# Altium schematic sheet 5V Supply and Protection.SchDoc
size A
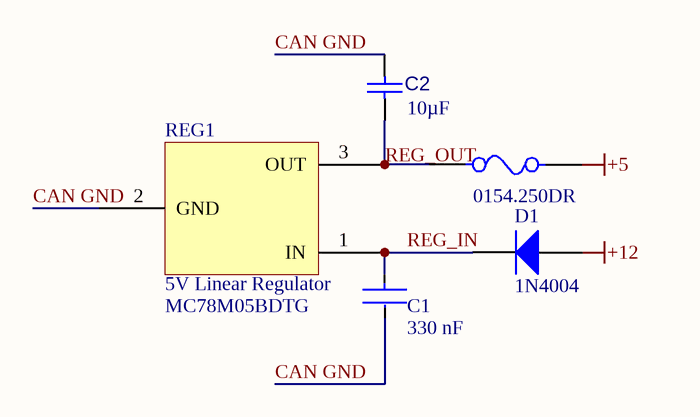
[diagram p0: 5V Supply and Protection.SchDoc]

## Parts
C1  value 330 nF  [FP-CC0603-DA-MFG]  (hidden comment: CC0603KRX7R7BB334)
C2  value 10µF  [CAPC0603(1608)100_L]  (hidden comment: Capacitor 10µF +/-20% 10V 0603)
D1  1N4004  [FAIR-DO-41-2]
FUSE  0154.250DR  [FP-0154-MFG]
REG1  MC78M05BDTG  [DPAK3]

## Nets
+5: FUSE.2
+12: D1.1(A)
CAN GND: C1.2 C2.2 REG1.2(GND)
REG_IN: C1.1 D1.2(K) REG1.1(IN)
REG_OUT: C2.1 FUSE.1 REG1.3(OUT)

## Notes on the sheet
- (in symbol MC78M05BDTG) 5V Linear Regulator

## Library data of the parts
C1 = CMP-03422-000838-1: CAP CER 0.33UF 16V X7R 0603; Manufacturer: YAGEO; Material: Ceramic; Tolerance: 0.1; Temperature Coefficient: 15%; Package: CC0603-DA; Footprint Url: http://www.yageo.com/exep/pages/download/literatures/UPY-C_GEN_24.pdf; Lead Free: Yes; Temperature: -55°C to +125°C; RoHS: TRUE; Temperature Range High: +125°C; Mouser Description: Multilayer Ceramic Capacitors MLCC - SMD/SMT 330nF 16V X7R 10%; Category: Cap; Temperature Characteristic: X7R; Octopart: https://octopart.com/cc0603krx7r7bb334-yageo-9291796; Voltage: 16 V; Device Class L1: Passive Components; Capacitance: 330 nF; ComponentLink2URL: http://www.yageo.com/documents/recent/UPY-GPHC_X7R_6.3V-to-50V_18.pdf; Temperature Range Low: -55°C; Digikey Description: CAP CER 0.33UF 16V X7R 0603; Manufacturer Part Number: CC0603KRX7R7BB334; Device Class L2: Capacitors; Voltage Rating: 16 V; Device Class L3: Ceramic Capacitors; ComponentLink2Description: Datasheet; Height: 0.9mm; Automotive: No
C2 = CMP-001-00075-2: Chip Capacitor, 10µF +/-20%, 10V, 0603, Thickness 1 mm; Tolerance: 10%; Mounting Technology: SMT; Pins: 2; Min Operating Temperature: -55°C; Case/Package: 0402; Max Operating Temperature: 85°C; Voltage Rating: 10V
D1 = CMP-004-00004-1: General Purpose Rectifier, 400 V, 1 A, -55 to 175 degC, 2-Pin DO-204AL (DO-41), RoHS, Tape and Reel; Manufacturer: Fairchild Semiconductor; Max Surge Current: 30A; Package Version: Rev. 2, 09/2008; Peak Reverse Current: 50A; Forward Voltage: 1.1V; Forward Current: 1A; Manufacturer URL: https://www.fairchildsemi.com/; Mounting Technology: TH; Pins: 2; Max Operating Temperature: 175°C; Packaging: TapeandReel; RoHS Compliant: True; Min Operating Temperature: -55°C; Package URL: http://www.fairchildsemi.com/dwg/DO/DO41A.pdf; Datasheet Version: Rev. 1.1.0, 11/2014; Package Description: 2-Pin Axial Lead, Dia 2.375 mm, Body Length 4.63 mm; Diameter: 2.72mm; Case/Package: DO-41-2; Package Reference: DO-41-2; Package Quantity: 5000; Datasheet URL: https://www.fairchildsemi.com/datasheets/1N/1N4004.pdf
FUSE = CMP-08605-000036-1: FUSE BOARD MNT 250MA 125VAC/VDC; Manufacturer: Littelfuse; Fuse Blow Speed: Fast; Fuse I2T: 0.0113A2Sec; Voltage Rating: 125V; Fuse Current: 0.25A; ComponentLink2URL: https://www.littelfuse.com/~/media/electronics/datasheets/fuses/littelfuse_fuse_154_154t_154l_154tl_datasheet.pdf.pdf; Category: Fuse; Device Class L1: Circuit Protection; Manufacturer Part Number: 0154.250DR; Mouser Description: Surface Mount Fuses Fuseblck w/ fuse.25A OMNI BLOK 154; Device Class L3: unset; Package: 0154; ComponentLink2Description: Datasheet; Temperature Range Low: -55°C; Max Fuse Dc Voltage: 125V; Temperature Range High: +125°C; Temperature: -55°C to +125°C; Device Class L2: Fuses; Max Fuse Ac Voltage: 125V; Lead Free: Yes; RoHS: TRUE; Digikey Description: FUSE BOARD MNT 250MA 125VAC/VDC; Height: 3.81mm; Automotive: No; Octopart: https://octopart.com/0154.250dr-littelfuse-565851
REG1 = MC78M05BDTG: IC REG LINEAR 5V 0.5A DPAK3; Supplier 1: RSComponents; Supplier Part Number 1: 8051784